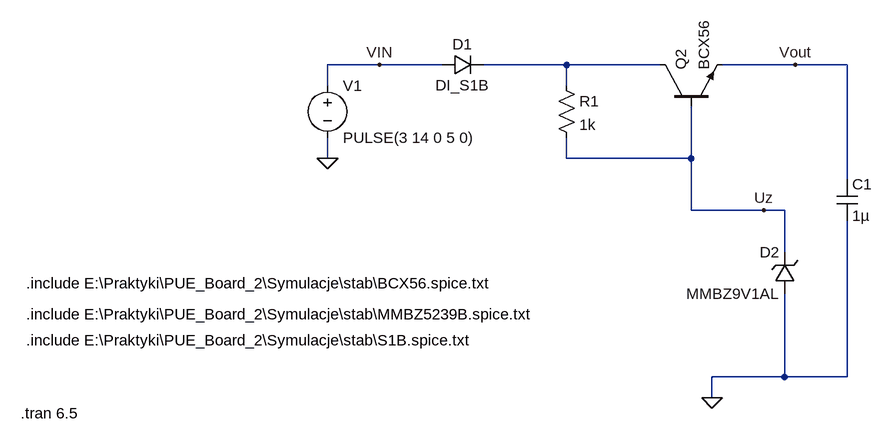
[diagram p0: schematic 2_zener_stab.asc]
2_zener_stab.asc, the LTspice schematic file:
Version 4
SHEET 1 880 680
WIRE -192 -112 -272 -112
WIRE -96 -112 -192 -112
WIRE 96 -112 -32 -112
WIRE 240 -112 96 -112
WIRE 448 -112 336 -112
WIRE 528 -112 448 -112
WIRE -272 -80 -272 -112
WIRE 96 -80 96 -112
WIRE -272 32 -272 0
WIRE 96 32 96 0
WIRE 288 32 288 -48
WIRE 288 32 96 32
WIRE 528 64 528 -112
WIRE 288 112 288 32
WIRE 400 112 288 112
WIRE 432 112 400 112
WIRE 432 176 432 112
WIRE 432 368 432 240
WIRE 432 368 320 368
WIRE 528 368 528 128
WIRE 528 368 432 368
WIRE 320 400 320 368
FLAG 320 400 0
FLAG -272 32 0
FLAG -192 -112 VIN
FLAG 448 -112 Vout
FLAG 400 112 Uz
SYMBOL npn 240 -48 R270
SYMATTR InstName Q2
SYMATTR Value BCX56
SYMBOL res 80 -96 R0
SYMATTR InstName R1
SYMATTR Value 1k
SYMATTR SpiceLine tol=5 pwr=0.25
SYMBOL diode -96 -96 R270
WINDOW 0 32 32 VTop 2
WINDOW 3 0 32 VBottom 2
SYMATTR InstName D1
SYMATTR Value DI_S1B
SYMBOL cap 512 64 R0
SYMATTR InstName C1
SYMATTR Value 1µ
SYMATTR SpiceLine V=25
SYMBOL voltage -272 -96 R0
WINDOW 123 0 0 Left 2
WINDOW 39 0 0 Left 2
SYMATTR InstName V1
SYMATTR Value PULSE(3 14 0 5 0)
SYMBOL zener 448 240 R180
WINDOW 0 24 64 Left 2
WINDOW 3 24 0 Left 2
SYMATTR InstName D2
SYMATTR Value MMBZ9V1AL
TEXT -744 424 Left 2 !.tran 6.5
TEXT -736 224 Left 2 !.include E:\\Praktyki\\PUE_Board_2\\Symulacje\\stab\\BCX56.spice.txt
TEXT -736 272 Left 2 !.include E:\\Praktyki\\PUE_Board_2\\Symulacje\\stab\\MMBZ5239B.spice.txt
TEXT -736 312 Left 2 !.include E:\\Praktyki\\PUE_Board_2\\Symulacje\\stab\\S1B.spice.txt

The netlist it stands for:
* 2_zener_stab.asc
Q2 N001 Uz Vout 0 BCX56
R1 N001 Uz 1k tol=5 pwr=0.25
D1 VIN N001 DI_S1B
C1 Vout 0 1µ V=25
V1 VIN 0 PULSE(3 14 0 5 0)
D2 0 Uz MMBZ9V1AL
.model D D
.lib standard.dio
.model NPN NPN
.model PNP PNP
.lib standard.bjt
.tran 6.5
.include E:\Praktyki\PUE_Board_2\Symulacje\stab\BCX56.spice.txt
.include E:\Praktyki\PUE_Board_2\Symulacje\stab\MMBZ5239B.spice.txt
.include E:\Praktyki\PUE_Board_2\Symulacje\stab\S1B.spice.txt
.backanno
.end

* Results of the author's LTspice run, read from the files saved beside the schematic
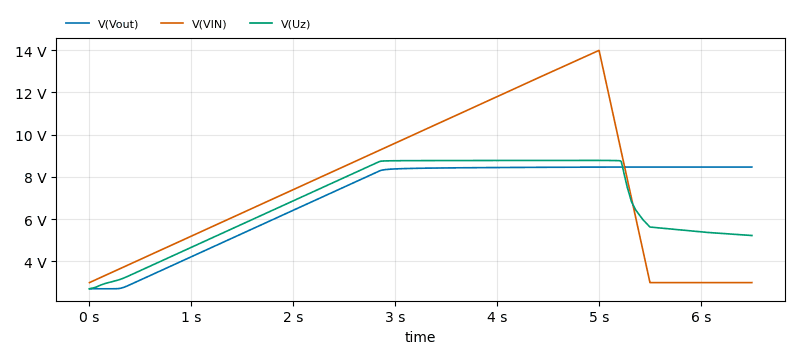
[diagram p1: Transient Analysis of 2_zener_stab.asc, plotted from the saved traces]
* Transient Analysis, 1 run:
*   V(Vout): min 2.707 V, max 8.468 V, average 7.022 V, rms 7.308 V, last 8.468 V
*   V(VIN): min 3 V, max 13.99 V, average 7.654 V, rms 8.442 V, last 3 V
*   V(Uz): min 2.707 V, max 8.783 V, average 6.785 V, rms 7.068 V, last 5.229 V